# Altium schematic sheet Power_Board.SchDoc: Power Stage Cuk 30 Amp GaN Board
size A2
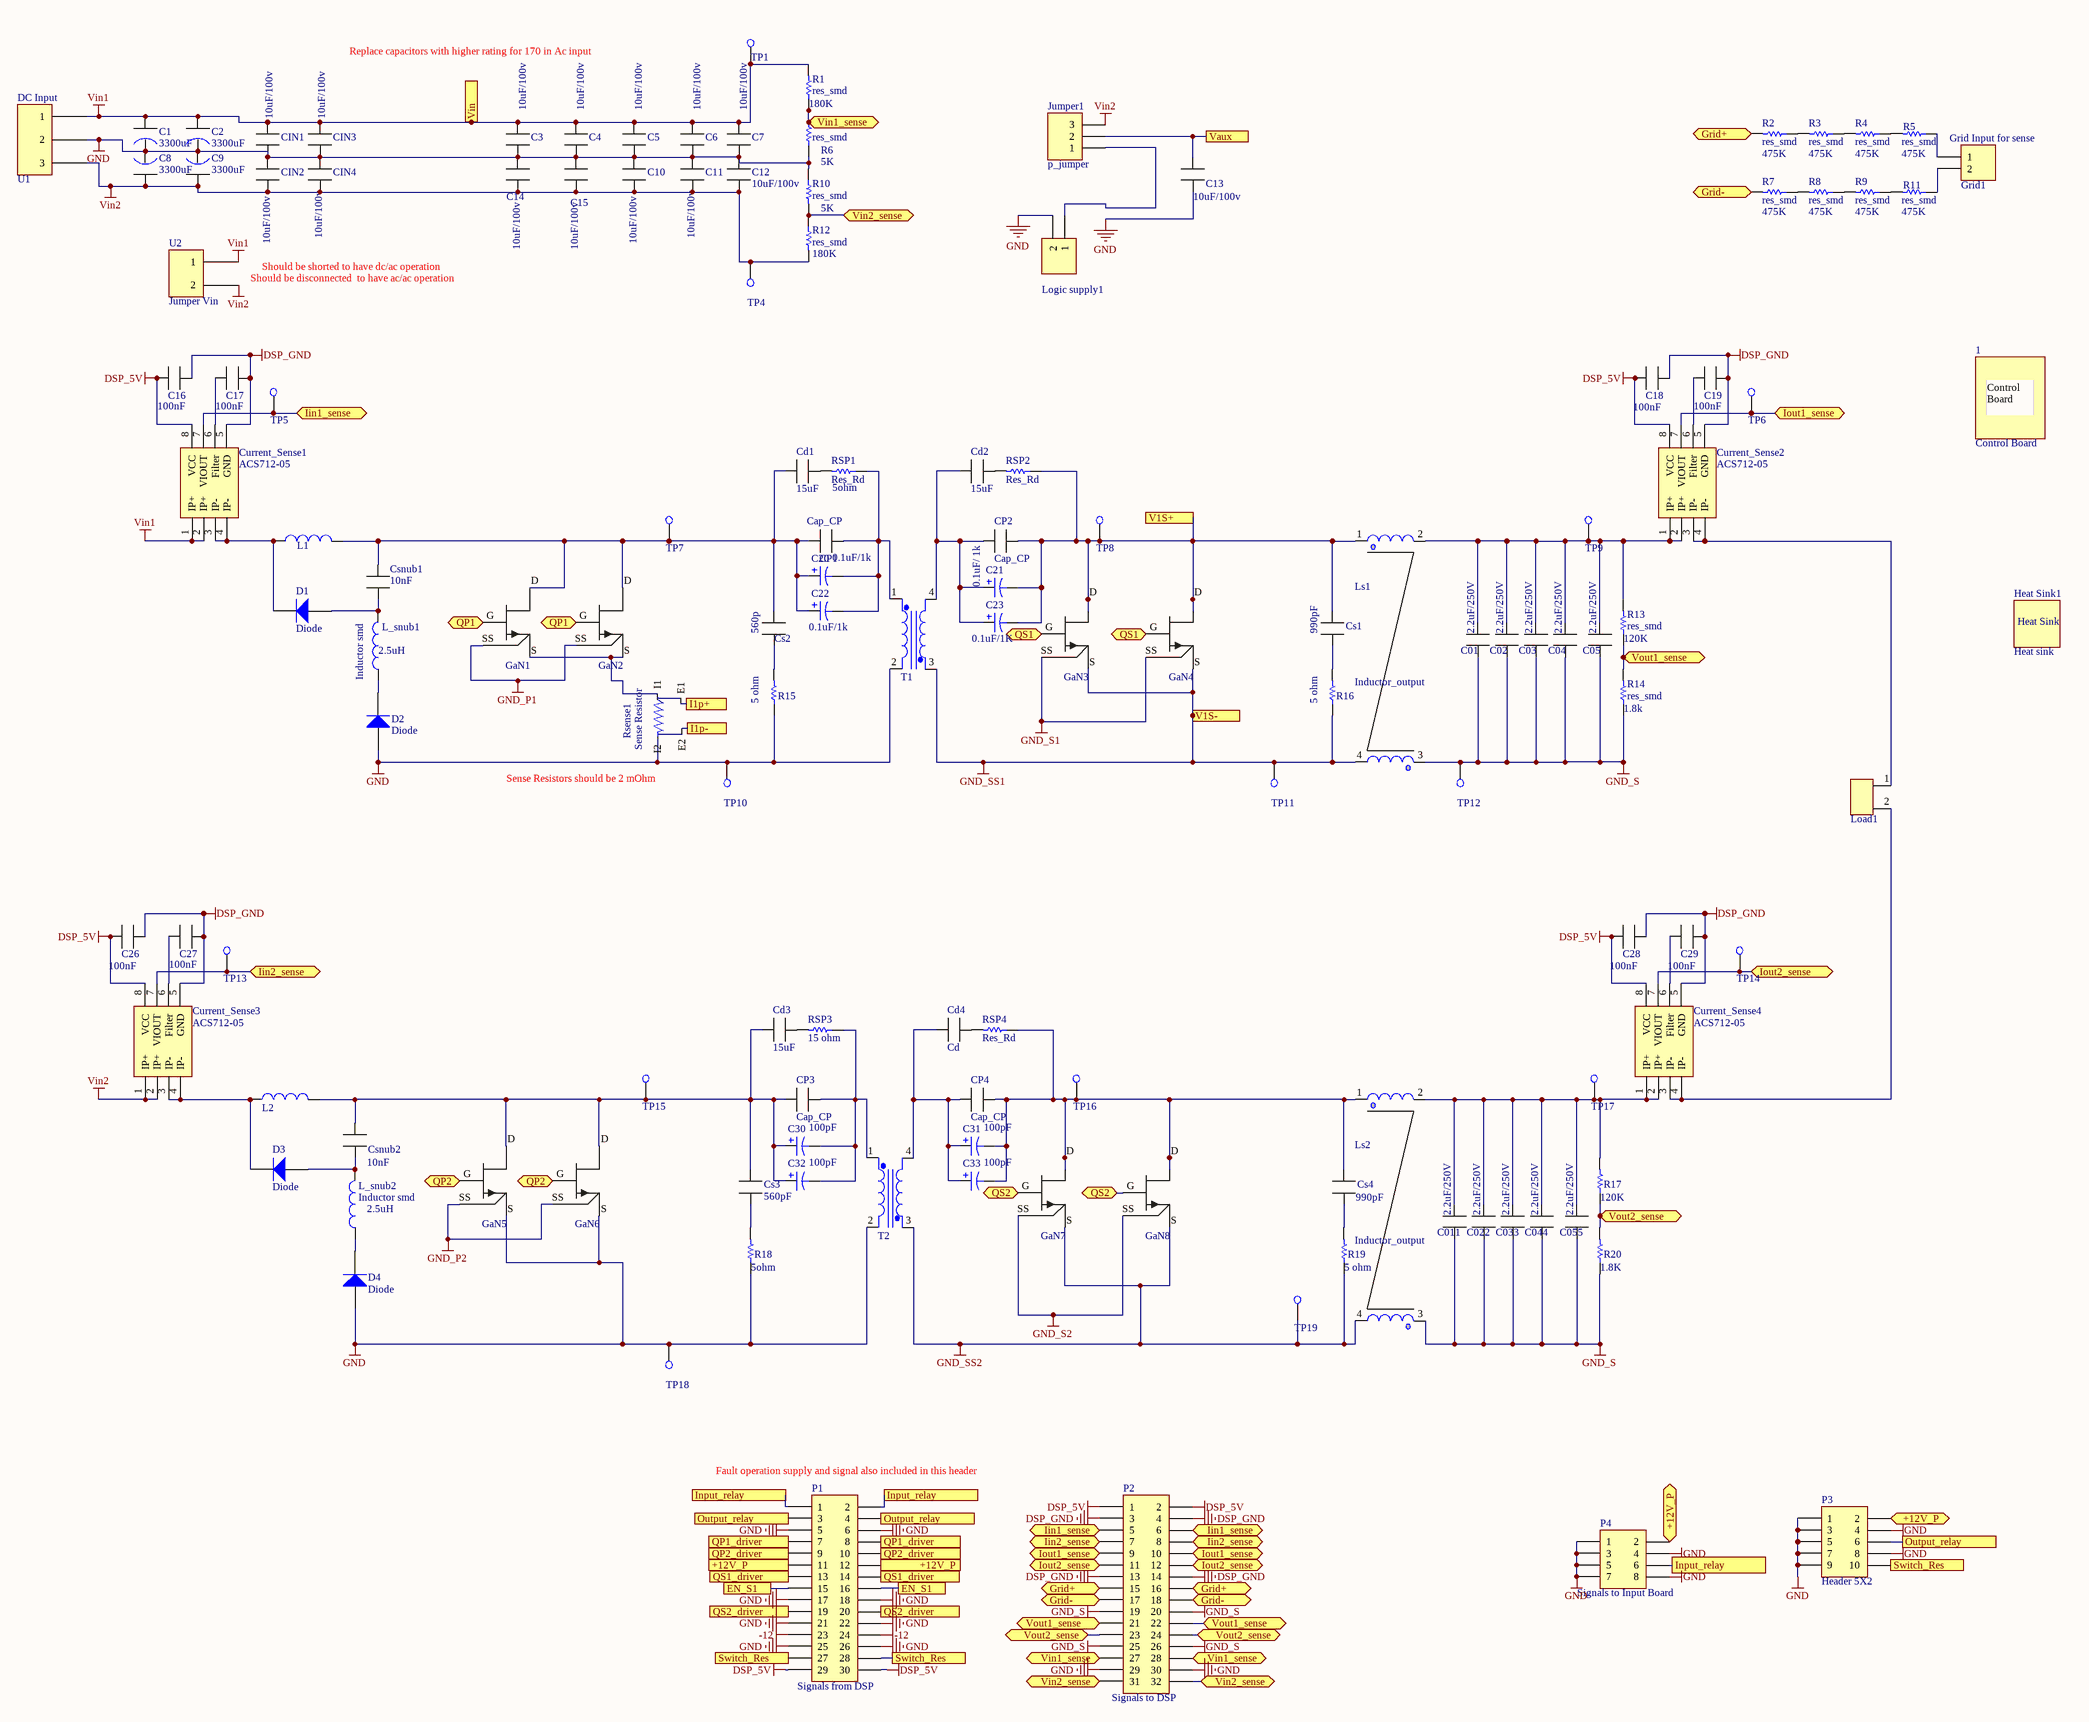
[diagram p0: Power_Board.SchDoc]

## Parts
1  Control Board  [Control Board]
C1  3300uF  [Cap_3300uF_35mm height]
C01  Output_cap  [Output cap]  (value not drawn)
C02  Output_cap  [Output cap]  (value not drawn)
C2  3300uF  [Cap_3300uF_35mm height]
C3  Output_cap  [Output cap]  (value not drawn)
C03  Output_cap  [Output cap]  (value not drawn)
C4  Output_cap  [Output cap]  (value not drawn)
C04  Output_cap  [Output cap]  (value not drawn)
C5  Output_cap  [Output cap]  (value not drawn)
C05  Output_cap  [Output cap]  (value not drawn)
C6  Output_cap  [Output cap]  (value not drawn)
C7  Output_cap  [Output cap]  (value not drawn)
C8  3300uF  [Cap_3300uF_35mm height]
C9  3300uF  [Cap_3300uF_35mm height]
C10  Output_cap  [Output cap]  (value not drawn)
C11  Output_cap  [Output cap]  (value not drawn)
C011  Output_cap  [Output cap]  (value not drawn)
C12  Output_cap  [Output cap]  (value not drawn)
C13  Output_cap  [Output cap]  (value not drawn)
C14  Output_cap  [Output cap]  (value not drawn)
C15  Output_cap  [Output cap]  (value not drawn)
C16  100nF  [Cap_SMD]
C17  100nF  [Cap_SMD]
C18  100nF  [Cap_SMD]
C19  100nF  [Cap_SMD]
C20  value 0.1uF/1k  [1812]  (hidden comment: Cap Pol3)
C21  value 0.1uF/ 1k  [1812]  (hidden comment: Cap Pol3)
C22  value 0.1uF/1k  [1812]  (hidden comment: Cap Pol3)
C022  Output_cap  [Output cap]  (value not drawn)
C23  value 0.1uF/1K  [1812]  (hidden comment: Cap Pol3)
C26  100nF  [Cap_SMD]
C27  100nF  [Cap_SMD]
C28  100nF  [Cap_SMD]
C29  100nF  [Cap_SMD]
C30  value 100pF  [1812]  (hidden comment: Cap Pol3)
C31  value 100pF  [1812]  (hidden comment: Cap Pol3)
C32  value 100pF  [1812]  (hidden comment: Cap Pol3)
C33  value 100pF  [1812]  (hidden comment: Cap Pol3)
C033  Output_cap  [Output cap]  (value not drawn)
C044  Output_cap  [Output cap]  (value not drawn)
C055  Output_cap  [Output cap]  (value not drawn)
Cd1  15uF  [Cd]
Cd2  15uF  [Cd]
Cd3  15uF  [Cd]
Cd4  Cd  [Cd]
CIN1  Output_cap  [Output cap]  (value not drawn)
CIN2  Output_cap  [Output cap]  (value not drawn)
CIN3  Output_cap  [Output cap]  (value not drawn)
CIN4  Output_cap  [Output cap]  (value not drawn)
CP1  Cap_CP  [Cap_cp]
CP2  Cap_CP  [Cap_cp]
CP3  Cap_CP  [Cap_cp]
CP4  Cap_CP  [Cap_cp]
Cs1  990pF  [Cap-Cs]
Cs2  560p  [Cap-Cs]
Cs3  560pF  [Cap-Cs]
Cs4  Cap cdv16ff101j03  [Cap-Cs]  (value not drawn)
Csnub1  Cap DPPM10S22K-F  [Cap-Csnub]  (value not drawn)
Csnub2  Cap DPPM10S22K-F  [Cap-Csnub]  (value not drawn)
Current_Sense1  ACS712-05  [SOIC-8]
Current_Sense2  ACS712-05  [SOIC-8]
Current_Sense3  ACS712-05  [SOIC-8]
Current_Sense4  ACS712-05  [SOIC-8]
D1  Diode  [TO-277A]
D2  Diode  [TO-277A]
D3  Diode  [TO-277A]
D4  Diode  [TO-277A]
GaN1  GS66508B  [GS66508B]  (value not drawn)
GaN2  GS66508B  [GS66508B]  (value not drawn)
GaN3  GS66508B  [GS66508B]  (value not drawn)
GaN4  GS66508B  [GS66508B]  (value not drawn)
GaN5  GS66508B  [GS66508B]  (value not drawn)
GaN6  GS66508B  [GS66508B]  (value not drawn)
GaN7  GS66508B  [GS66508B]  (value not drawn)
GaN8  GS66508B  [GS66508B]  (value not drawn)
Grid1  Grid Input for sense  [Auxlilary connector]
Heat_Sink1  Heat sink  [Heat Sink]
Jumper1  p_jumper  [Header1*3]
L1  inductor  [Inductor_small]  (value not drawn)
L2  inductor  [Inductor_small_mirror]  (value not drawn)
L_snub1  Inductor smd  [Inductor surface mount]
L_snub2  Inductor smd  [Inductor surface mount]
Load1  Connector 60A  [Connector_60A]  (value not drawn)
Logic_supply1  Auxilary connector  [Auxlilary connector]  (value not drawn)
Ls1  Inductor_output  [Inductor output]
Ls2  Inductor_output  [Inductor output]
P1  Signals from DSP  [HDR2X15]
P2  Signals to DSP  [HDR2X16]
P3  Header 5X2  [HDR2X5]
P4  Signals to Input Board  [HDR2X4]
R1  res_smd  [res_smd]
R2  res_smd  [res_smd]
R3  res_smd  [res_smd]
R4  res_smd  [res_smd]
R5  res_smd  [res_smd]
R6  res_smd  [res_smd]
R7  res_smd  [res_smd]
R8  res_smd  [res_smd]
R9  res_smd  [res_smd]
R10  res_smd  [res_smd]
R11  res_smd  [res_smd]
R12  res_smd  [res_smd]
R13  res_smd  [res_smd]
R14  res_smd  [res_smd]
R15  res_snubber  [Res_Snub]  (value not drawn)
R16  res_snubber  [Res_Snub]  (value not drawn)
R17  res_smd  [res_smd]  (value not drawn)
R18  res_snubber  [Res_Snub]  (value not drawn)
R19  res_snubber  [Res_Snub]  (value not drawn)
R20  res_smd  [res_smd]  (value not drawn)
Rsense1  Sense Resistor  [Sense resistor]
RSP1  Res_Rd  [Res-RS]
RSP2  Res_Rd  [Res-RS]
RSP3  15 ohm  [Res-RS]
RSP4  Res_Rd  [Res-RS]
T1  Transformer  [Transformer]  (value not drawn)
T2  Transformer  [Big_transformer mirror]  (value not drawn)
TP1  Test Point  [Test Point]  (value not drawn)
TP4  Test Point  [Test Point]  (value not drawn)
TP5  Test Point  [Test Point]  (value not drawn)
TP6  Test Point  [Test Point]  (value not drawn)
TP7  Test Point  [Test Point]  (value not drawn)
TP8  Test Point  [Test Point]  (value not drawn)
TP9  Test Point  [Test Point]  (value not drawn)
TP10  Test Point  [Test Point]  (value not drawn)
TP11  Test Point  [Test Point]  (value not drawn)
TP12  Test Point  [Test Point]  (value not drawn)
TP13  Test Point  [Test Point]  (value not drawn)
TP14  Test Point  [Test Point]  (value not drawn)
TP15  Test Point  [Test Point]  (value not drawn)
TP16  Test Point  [Test Point]  (value not drawn)
TP17  Test Point  [Test Point]  (value not drawn)
TP18  Test Point  [Test Point]  (value not drawn)
TP19  Test Point  [Test Point]  (value not drawn)
U1  DC Input  [P-terminal 3]
U2  Jumper Vin  [P-Terminal 2]

## Ports
+12V_P, +12V_P (bidir), EN_S1, Grid+ (bidir), Grid- (bidir), I1p+, I1p-, Iin1_sense (bidir), Iin2_sense (bidir), Input_relay, Iout1_sense (bidir), Iout2_sense (bidir), Output_relay, QP1 (bidir), QP1_driver, QP2 (bidir), QP2_driver, QS1 (bidir), QS1_driver, QS2 (bidir), QS2_driver, Switch_Res, V1S+, V1S-, Vaux, Vin, Vin1_sense (bidir), Vin2_sense (bidir), Vout1_sense (bidir), Vout2_sense (bidir)

## Nets
-12: P1.23 P1.24
DSP_5V: C16.1 C18.1 C26.1 C28.1 Current_Sense1.8(VCC) Current_Sense2.8(VCC) Current_Sense3.8(VCC) Current_Sense4.8(VCC) P1.29 P1.30 P2.1 P2.2
DSP_GND: C16.2 C17.2 C18.2 C19.2 C26.2 C27.2 C28.2 C29.2 Current_Sense1.5(GND) Current_Sense2.5(GND) Current_Sense3.5(GND) Current_Sense4.5(GND) P2.3 P2.4 P2.13 P2.14
GND: C1.- C2.- C3.2 C4.2 C5.2 C6.2 C7.2 C8.- C9.- C10.2 C11.2 C12.2 C13.2 C14.2 C15.2 CIN1.2 CIN2.1 CIN3.2 CIN4.1 D2.1(A) D4.1(A) GaN5.S GaN6.S Logic_supply1.2 P1.5 P1.6 P1.17 P1.18 P1.21 P1.22 P1.25 P1.26 P2.29 P2.30 P3.1 P3.3 P3.4 P3.5 P3.7 P3.8 P3.9 P4.1 P4.3 P4.4 P4.5 P4.7 P4.8 R6.1 R10.1 R15.1 R18.1 Rsense1.2(I2) T1.2(P2) T2.2(P2) TP10.1(TP?) TP18.1(TP?) U1.2
GND_P1: GaN1.SS GaN2.SS
GND_P2: GaN5.SS GaN6.SS
GND_S: C01.2 C02.2 C03.2 C04.2 C05.2 C011.2 C022.2 C033.2 C044.2 C055.2 Ls1.3(-) Ls2.3(-) P2.19 P2.20 P2.25 P2.26 R14.1 R20.1 TP12.1(TP?)
GND_S1: GaN3.SS GaN4.SS
GND_S2: GaN7.SS GaN8.SS
GND_SS1: GaN3.S GaN4.S Ls1.4(+) R16.1 T1.3(S2) TP11.1(TP?) ; port V1S-
GND_SS2: GaN7.S GaN8.S Ls2.4(+) R19.1 T2.3(S2) TP19.1(TP?)
Vin1: C1.+ C2.+ C3.1 C4.1 C5.1 C6.1 C7.1 CIN1.1 CIN3.1 Current_Sense1.1(IP+) Current_Sense1.2(IP+) R1.2 TP1.1(TP?) U1.1 U2.1 ; port Vin
Vin2: C8.+ C9.+ C10.1 C11.1 C12.1 C14.1 C15.1 CIN2.2 CIN4.2 Current_Sense3.1(IP+) Current_Sense3.2(IP+) Jumper1.3 R12.2 TP4.1(TP?) U1.3 U2.2
+12V_P: P1.11 P1.12 P3.2 P4.2 ; port +12V_P
EN_S1: P1.15 P1.16 ; port EN_S1
Grid+: P2.15 P2.16 R2.2 ; port Grid+
Grid-: P2.17 P2.18 R7.2 ; port Grid-
I1p+: Rsense1.3(E1) ; port I1p+
I1p-: Rsense1.4(E2) ; port I1p-
Iin1_sense: Current_Sense1.7(VIOUT) P2.5 P2.6 TP5.1(TP?) ; port Iin1_sense
Iin2_sense: Current_Sense3.7(VIOUT) P2.7 P2.8 TP13.1(TP?) ; port Iin2_sense
Input_relay: P1.1 P1.2 P4.6 ; port Input_relay
Iout1_sense: Current_Sense2.7(VIOUT) P2.9 P2.10 TP6.1(TP?) ; port Iout1_sense
Iout2_sense: Current_Sense4.7(VIOUT) P2.11 P2.12 TP14.1(TP?) ; port Iout2_sense
Output_relay: P1.3 P1.4 P3.6 ; port Output_relay
QP1: GaN1.G GaN2.G ; port QP1
QP1_driver: P1.7 P1.8 ; port QP1_driver
QP2: GaN5.G GaN6.G ; port QP2
QP2_driver: P1.9 P1.10 ; port QP2_driver
QS1: GaN3.G GaN4.G ; port QS1
QS1_driver: P1.13 P1.14 ; port QS1_driver
QS2: GaN7.G GaN8.G ; port QS2
QS2_driver: P1.19 P1.20 ; port QS2_driver
Switch_Res: P1.27 P1.28 P3.10 ; port Switch_Res
V1S+: C21.2 C23.2 CP2.2 Cs1.1 GaN3.D GaN4.D Ls1.1(+) RSP2.1 TP8.1(TP?) ; port V1S+
Vaux: C13.1 Jumper1.2 ; port Vaux
Vin1_sense: P2.27 P2.28 R1.1 R6.2 ; port Vin1_sense
Vin2_sense: P2.31 P2.32 R10.2 R12.1 ; port Vin2_sense
Vout1_sense: P2.21 P2.22 R13.1 R14.2 ; port Vout1_sense
Vout2_sense: P2.23 P2.24 R17.1 R20.2 ; port Vout2_sense
NetC01_1: C01.1 C02.1 C03.1 C04.1 C05.1 Current_Sense2.1(IP+) Current_Sense2.2(IP+) Ls1.2(-) R13.2 TP9.1(TP?)
NetC011_1: C011.1 C022.1 C033.1 C044.1 C055.1 Current_Sense4.1(IP+) Current_Sense4.2(IP+) Ls2.2(-) R17.2 TP17.1(TP?)
NetC17_1: C17.1 Current_Sense1.6(Filter)
NetC19_1: C19.1 Current_Sense2.6(Filter)
NetC20_1: C20.1 C22.1 Cd1.1 CP1.1 Cs2.1 Csnub1.1 GaN1.D GaN2.D L1.2(-) TP7.1(TP?)
NetC20_2: C20.2 C22.2 CP1.2 RSP1.1 T1.1(P1)
NetC21_1: C21.1 C23.1 Cd2.1 CP2.1 T1.4(S1)
NetC27_1: C27.1 Current_Sense3.6(Filter)
NetC29_1: C29.1 Current_Sense4.6(Filter)
NetC30_1: C30.1 C32.1 Cd3.1 CP3.1 Cs3.1 Csnub2.1 GaN5.D GaN6.D L2.2(-) TP15.1(TP?)
NetC30_2: C30.2 C32.2 CP3.2 RSP3.1 T2.1(P1)
NetC31_1: C31.1 C33.1 Cd4.1 CP4.1 T2.4(S1)
NetC31_2: C31.2 C33.2 CP4.2 Cs4.1 GaN7.D GaN8.D Ls2.1(+) RSP4.1 TP16.1(TP?)
NetCd1_2: Cd1.2 RSP1.2
NetCd2_2: Cd2.2 RSP2.2
NetCd3_2: Cd3.2 RSP3.2
NetCd4_2: Cd4.2 RSP4.2
NetCs1_2: Cs1.2 R16.2
NetCs2_2: Cs2.2 R15.2
NetCs3_2: Cs3.2 R18.2
NetCs4_2: Cs4.2 R19.2
NetCsnub1_2: Csnub1.2 D1.1(A) L_snub1.2(-)
NetCsnub2_2: Csnub2.2 D3.1(A) L_snub2.2(-)
NetCurrent_Sense1_3: Current_Sense1.3(IP-) Current_Sense1.4(IP-) D1.2(K) L1.1(+)
NetCurrent_Sense2_3: Current_Sense2.3(IP-) Current_Sense2.4(IP-) Load1.1
NetCurrent_Sense3_3: Current_Sense3.3(IP-) Current_Sense3.4(IP-) D3.2(K) L2.1(+)
NetCurrent_Sense4_3: Current_Sense4.3(IP-) Current_Sense4.4(IP-) Load1.2
NetD2_2: D2.2(K) L_snub1.1(+)
NetD4_2: D4.2(K) L_snub2.1(+)
NetGaN1_S: GaN1.S GaN2.S Rsense1.1(I1)
NetGrid1_1: Grid1.1 R5.1
NetGrid1_2: Grid1.2 R11.1
NetJumper1_1: Jumper1.1 Logic_supply1.1
NetR2_1: R2.1 R3.2
NetR3_1: R3.1 R4.2
NetR4_1: R4.1 R5.2
NetR7_1: R7.1 R8.2
NetR8_1: R8.1 R9.2
NetR9_1: R9.1 R11.2

## Notes on the sheet
- Replace capacitors with higher rating for 170 in Ac input
- Should be disconnected  to have ac/ac operation
- Should be shorted to have dc/ac operation
- Sense Resistors should be 2 mOhm
- (near P1) Fault operation supply and signal also included in this header
- (in symbol Cap-CS) 990pF
- (in symbol Cap-Csnub) 10nF
- (in symbol Heat sink) Heat Sink
- (in symbol Inductor smd) 2.5uH
- (in symbol Output_cap) 10uF/100v; 2.2uF/250V
- (in symbol Res_Rd) 5ohm
- (in symbol res_smd) 120K; 1.8k; 180K; 5K; 1.8K; 475K
- (in symbol res_snubber) 5 ohm; 5ohm

## Library data of the parts
C1 C2 C8 C9 = 3300uF: LLS2A332MELC
C16-C19 C26-C29 = Cap_SMD
C20-C23 C30-C33 = Cap Pol3: Polarized Capacitor (Surface Mount); Published: 8-Jun-2000; LatestRevisionDate: 29-May-2009; LatestRevisionNote: IPC-7351 Footprint Added.; PackageReference: C0805; Publisher: Altium Limited; PackageDescription: Chip Capacitor
Cd1-Cd3 = Cd
Cs1-Cs4 = Cap-CS
Csnub1 Csnub2 = Cap-Csnub
Current_Sense1-Current_Sense4 = Current Sensor 5A
D1-D4 = Diode: VS-4ESH02HM3
Grid1 = Auxilary connector
P1 = Header 15X2: Header, 15-Pin, Dual row; LatestRevisionDate: 17-Jul-2002; LatestRevisionNote: Re-released for DXP Platform.; Publisher: Altium Limited
P2 = Header 16X2: Header, 16-Pin, Dual row; LatestRevisionDate: 17-Jul-2002; LatestRevisionNote: Re-released for DXP Platform.; Publisher: Altium Limited
P3 = Header 5X2: Header, 5-Pin, Dual row; LatestRevisionDate: 17-Jul-2002; LatestRevisionNote: Re-released for DXP Platform.; Publisher: Altium Limited
P4 = Header 4X2: Header, 4-Pin, Dual row; LatestRevisionDate: 17-Jul-2002; LatestRevisionNote: Re-released for DXP Platform.; Publisher: Altium Limited
R1-R14 R17 R20 = res_smd: smd_res
R15 R16 R18 R19 = res_snubber: snubber_res_film
RSP3 = Res_Rd
U1 = P-Terminal 3
U2 = P-Terminal 2